# EAGLE schematic EAA690_RFID_In (EAGLE 6.6.0)
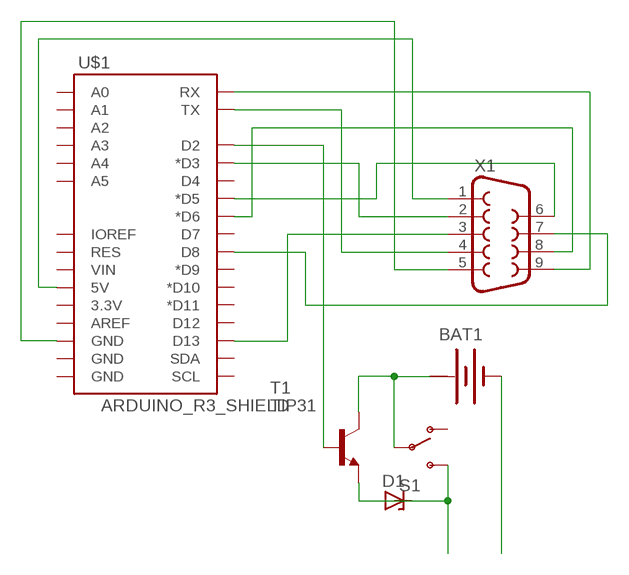
[diagram p0: schematic, sheet 1]

## Parts
BAT1  BATTERY  [BATTERY]
D1  ZENER-DIODESOD64-12  [SOD64Z12]
S1  SWITCH-SPDTPTH  [SWITCH-SPDT]
T1  TIP31  [TO220]
U$1  ARDUINO_R3_SHIELD  [UNO_R3_SHIELD]
X1  DB9FEMALE  [DB9]

## Nets
N$1: U$1.RX X1.9
N$2: U$1.TX X1.4
N$3: T1.1(B) U$1.D2
N$4: U$1.D3(*D3) X1.2
N$5: U$1.D5(*D5) X1.6
N$6: U$1.D6(*D6) X1.8
N$7: U$1.D8 X1.7
N$8: U$1.5V X1.1
N$9: U$1.GND@2(GND) X1.5
N$10: U$1.D13 X1.3
N$11: D1.A D1.C S1.3(S) T1.3(E)
N$12: BAT1.-
N$15: BAT1.+ S1.2(P) T1.2(C)
Unconnected: S1.1(O) U$1.3.3V U$1.A0 U$1.A1 U$1.A2 U$1.A3 U$1.A4 U$1.A5 U$1.AREF U$1.D4 U$1.D7 U$1.D9(*D9) U$1.D10(*D10) U$1.D11(*D11) U$1.D12 U$1.GND@0(GND) U$1.GND@1(GND) U$1.IOREF U$1.RES U$1.SCL U$1.SDA U$1.VIN

## Power pins joined to a net without a drawn wire
+: BAT1.+@1(+)

## Library data of the parts
BAT1 = special:BATTERY: BATTERY
D1 = diode:ZENER-DIODE: Z-Diode
S1 = SparkFun-Electromechanical:SWITCH-SPDT: SPDT Switch Simple slide switch, Spark Fun Electronics SKU : COM-00102 DPDT SMT slide switch, AYZ0202, SWCH-08179
T1 = transistor:TIP31: NPN Transistor Medium Power Linear Switching Applications Source: http://onsemi.com
U$1 = SparkFun-Boards:ARDUINO_R3_SHIELD: Shield form compatible with the Arduino Uno R3.
X1 = SparkFun-Connectors:DB9: DB9 Connector Standard DB9 (D-Sub 9) serial connector. Can be used for CAN bus as well as RS485 and RS232. Footprint production proven. Spark Fun Electronics SKU : PRT-00429